# Altium schematic sheet heat.SchDoc
size A4
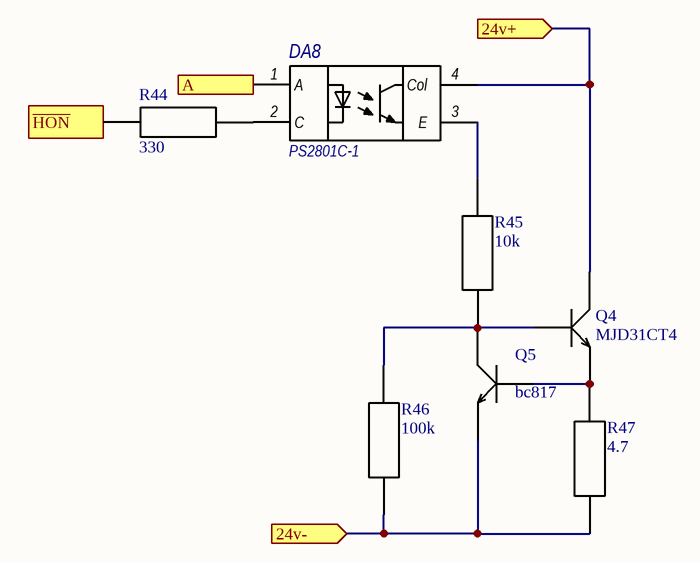
[diagram p0: heat.SchDoc]

## Parts
DA8  PS2801C-1  [SSOP-4N]
Q4  MJD31CT4  [d-pak]
Q5  bc817  [sot23]
R44  330  [res_0402]
R45  10k  [0805-res]
R46  100k  [0805-res]
R47  4.7  [2512_res]

## Ports
24v+ (in), 24v- (in), A (in), ~{HON} (in)

## Nets
24v+: DA8.4(Col) Q4.2(K) ; port 24v+
24v-: Q5.3(E) R46.1 R47.1 ; port 24v-
A: DA8.1(A) ; port A
~{HON}: R44.1 ; port ~{HON}
NetDA8_2: DA8.2(C) R44.2
NetDA8_3: DA8.3(E) R45.2
NetQ4_1: Q4.1(B) Q5.2(K) R45.1 R46.2
NetQ4_3: Q4.3(E) Q5.1(B) R47.2

## Library data of the parts
Q4 = npn: bc817
Q5 = npn
R44-R47 = res
DA8 = PS2801C-1: Type: PS2801C-1